# EAGLE design WILD_USB (EAGLE 9.6.2)
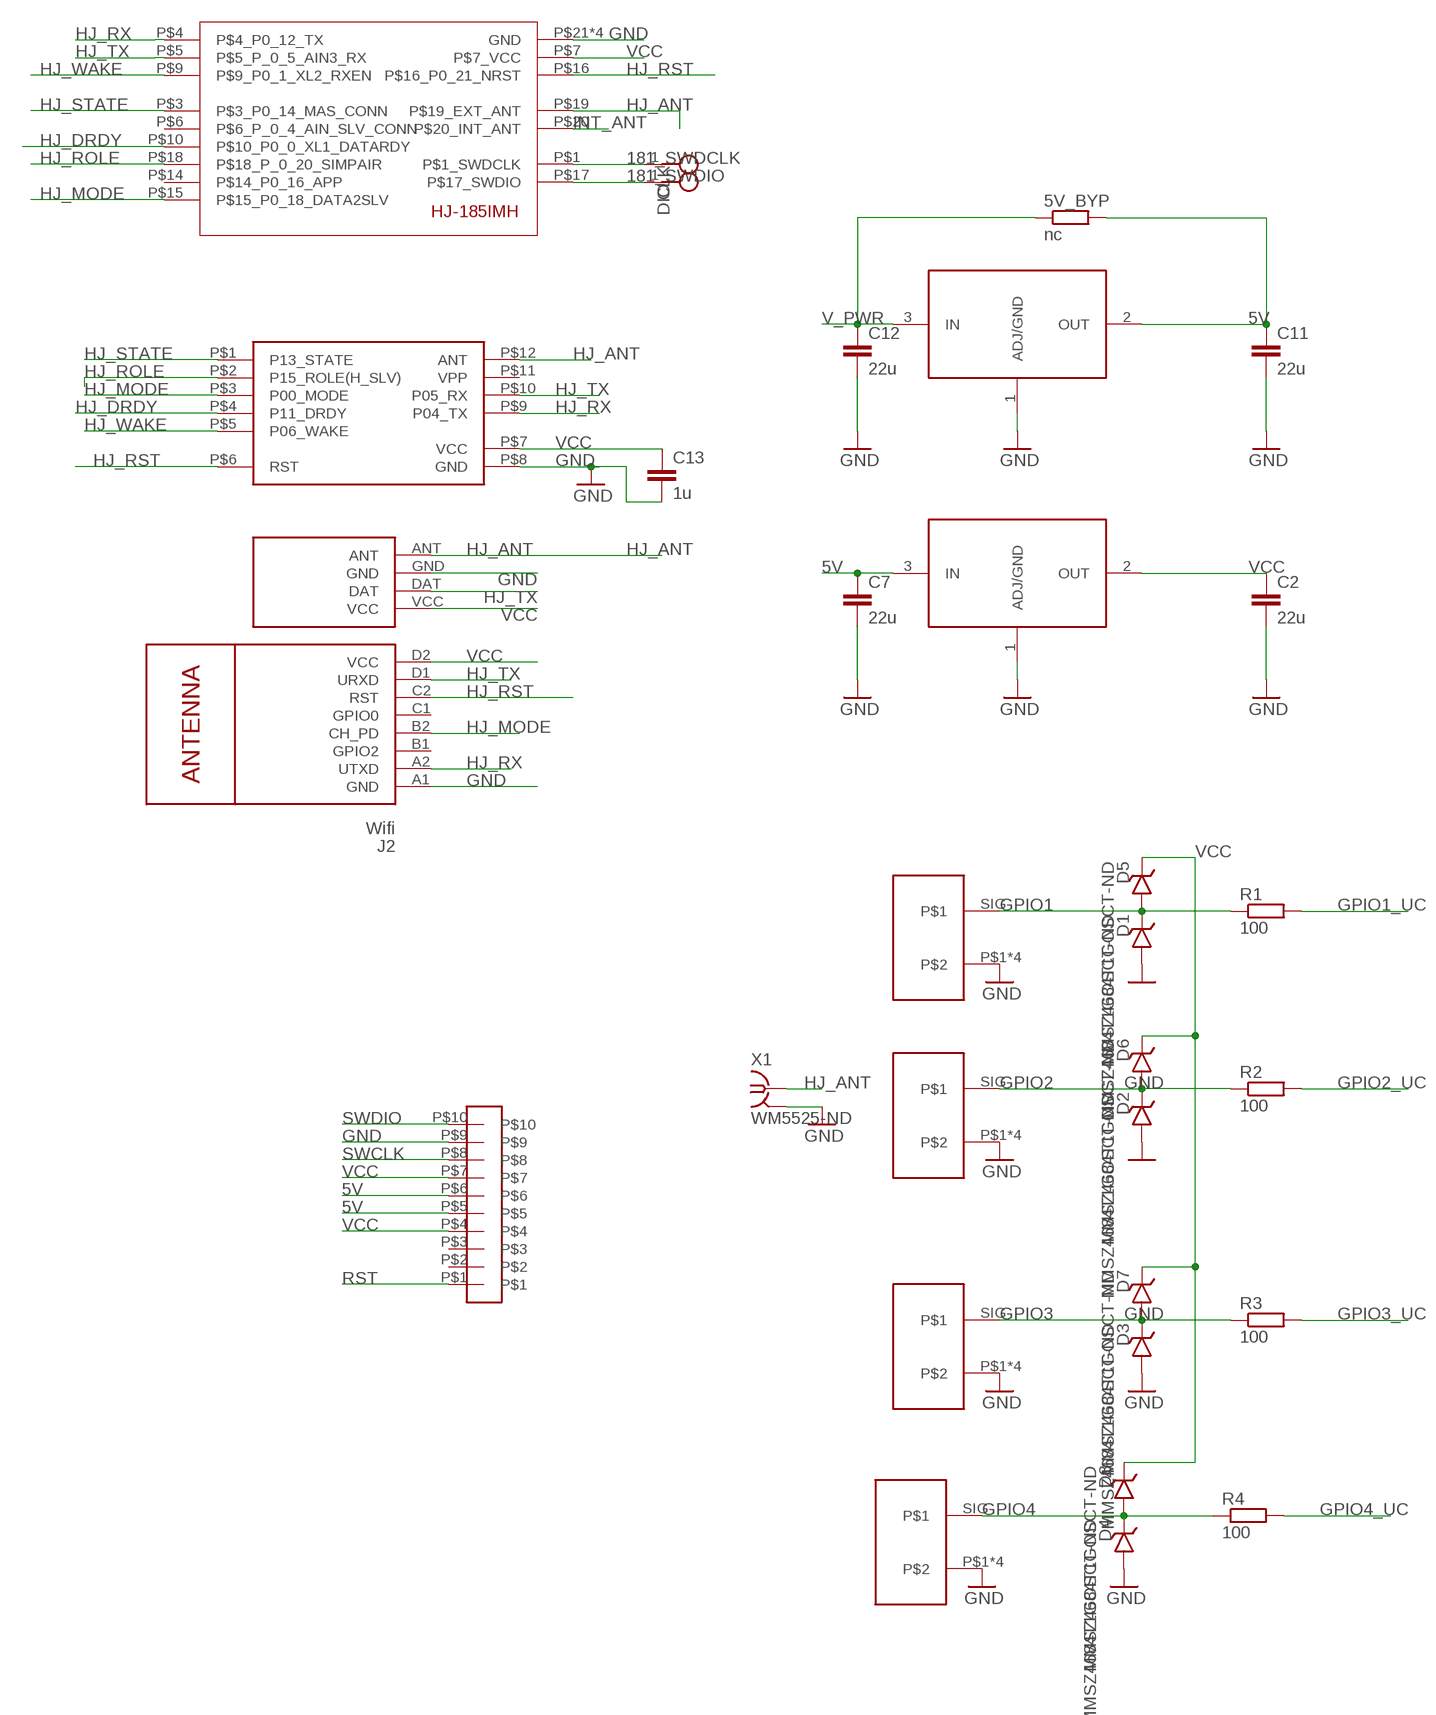
[diagram p0: schematic, sheet 1, part 1 of 2]
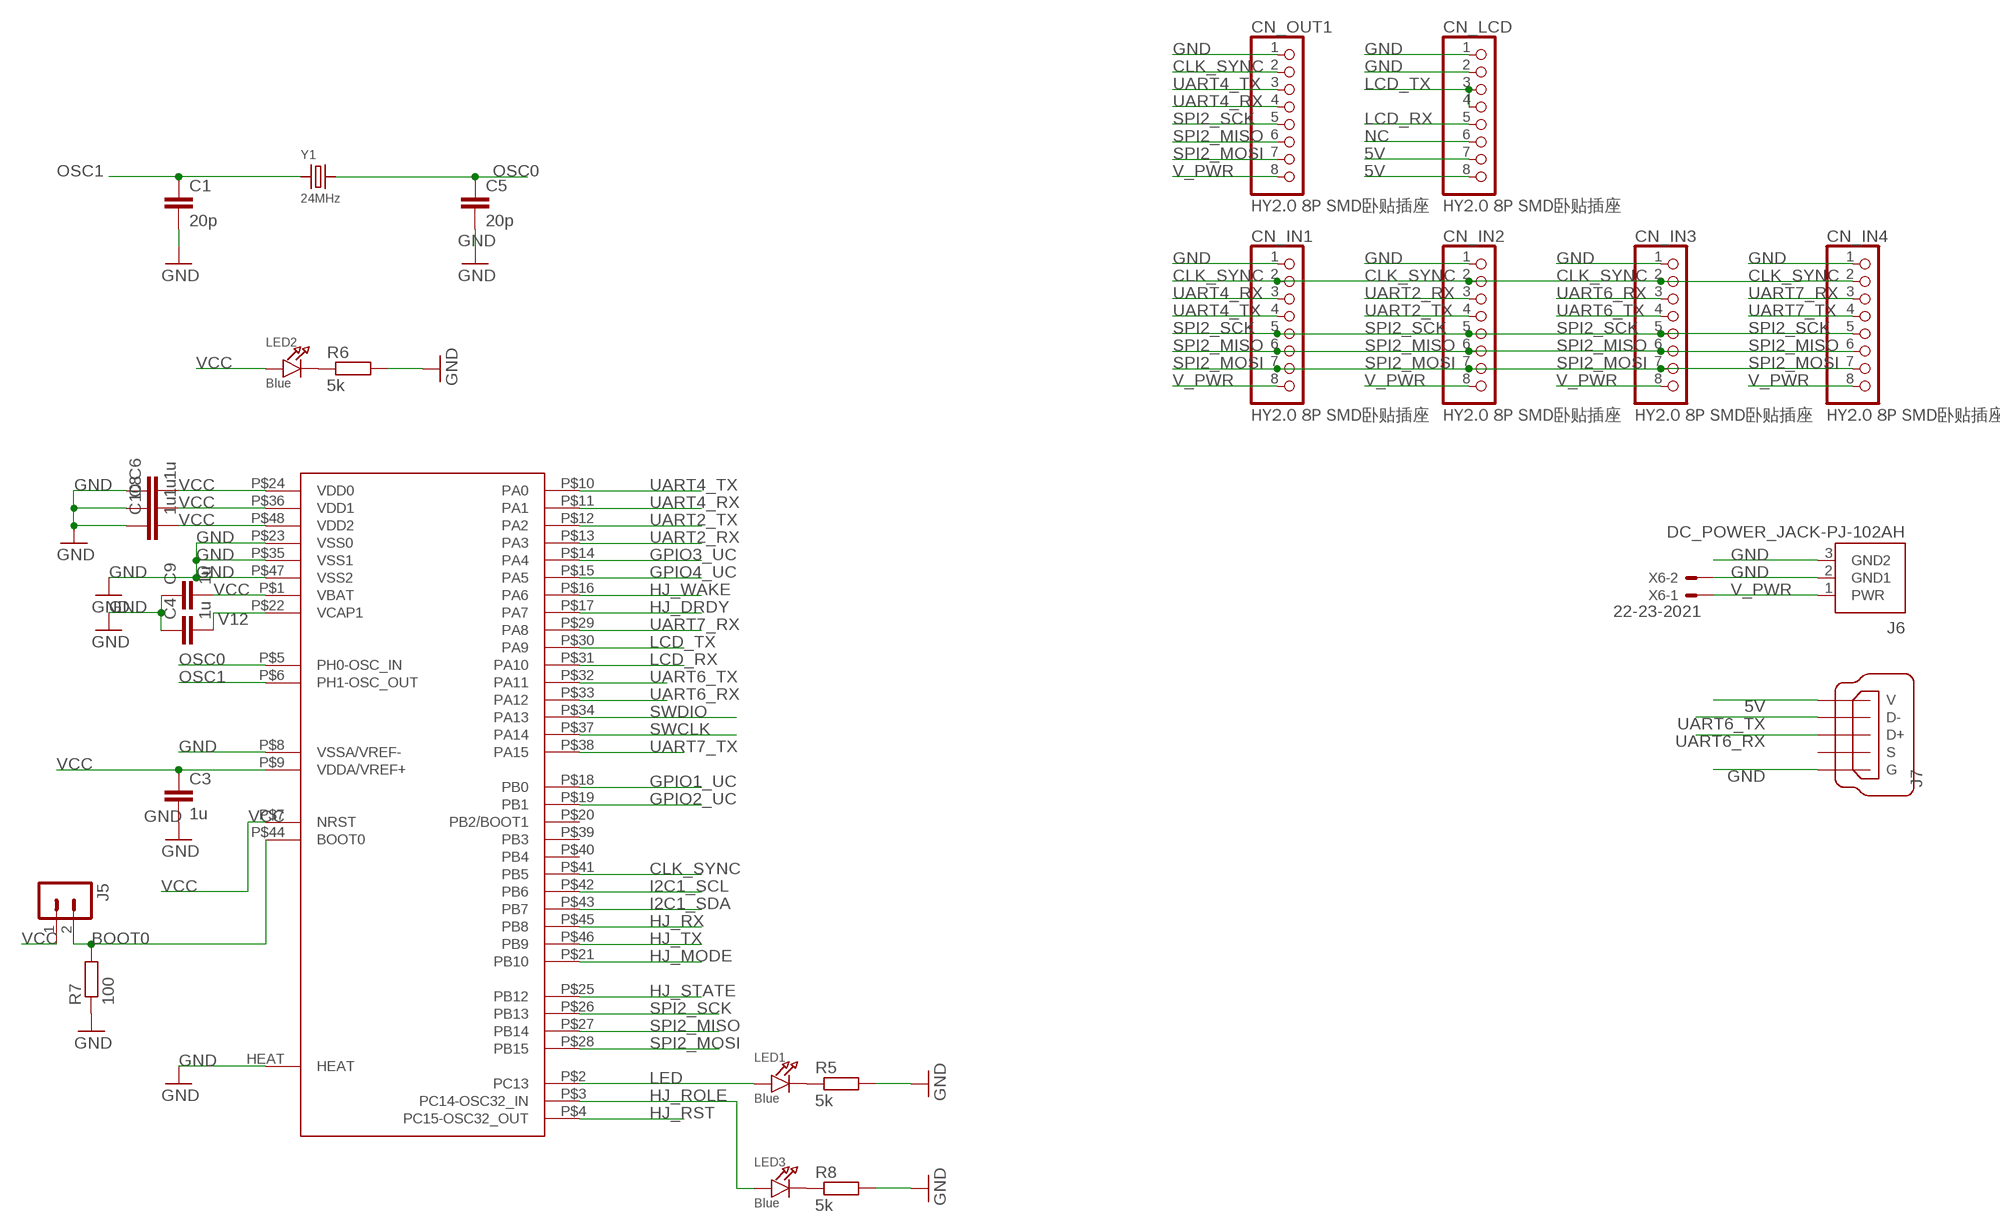
[diagram p1: schematic, sheet 1, part 2 of 2]

## Parts
5V_BYP  nc  RR1206  [R1206]
C1  20p  CC1206  [C1206]
C2  22u  CC1206  [C1206]
C3  1u  CC1206  [C1206]
C4  1u  CC1206  [C1206]
C5  20p  CC1206  [C1206]
C6  1u  CC1206  [C1206]
C7  22u  CC1206  [C1206]
C8  1u  CC1206  [C1206]
C9  1u  CC1206  [C1206]
C10  1u  CC1206  [C1206]
C11  22u  CC1206  [C1206]
C12  22u  CC1206  [C1206]
C13  1u  CC1206  [C1206]
CLK  TESTPOINT_SMALL  [TESTPOINT_SMALL]
CN_IN1  HY2.0 8P SMD卧贴插座  JST_8PIN  [JSTPH8]
CN_IN2  HY2.0 8P SMD卧贴插座  JST_8PIN  [JSTPH8]
CN_IN3  HY2.0 8P SMD卧贴插座  JST_8PIN  [JSTPH8]
CN_IN4  HY2.0 8P SMD卧贴插座  JST_8PIN  [JSTPH8]
CN_LCD  HY2.0 8P SMD卧贴插座  JST_8PIN  [JSTPH8]
CN_OUT1  HY2.0 8P SMD卧贴插座  JST_8PIN  [JSTPH8]
D1  MMSZ4684T1GOSCT-ND  DIODE_ZENER_SOD-123  [SOD-123]
D2  MMSZ4684T1GOSCT-ND  DIODE_ZENER_SOD-123  [SOD-123]
D3  MMSZ4684T1GOSCT-ND  DIODE_ZENER_SOD-123  [SOD-123]
D4  MMSZ4684T1GOSCT-ND  DIODE_ZENER_SOD-123  [SOD-123]
D5  MMSZ4684T1GOSCT-ND  DIODE_ZENER_SOD-123  [SOD-123]
D6  MMSZ4684T1GOSCT-ND  DIODE_ZENER_SOD-123  [SOD-123]
D7  MMSZ4684T1GOSCT-ND  DIODE_ZENER_SOD-123  [SOD-123]
D8  MMSZ4684T1GOSCT-ND  DIODE_ZENER_SOD-123  [SOD-123]
DIO  TESTPOINT_SMALL  [TESTPOINT_SMALL]
J1  Sub-GHz  SYN115  [SYN115]
J2  Wifi  WIRELESS-WIFI-ESP-01  [WIRELESS-WIFI-ESP-01]
J3  2*5P 2.54mm 双排母 母座  2.54MM_2X5  [2.54MM_2X5]
J5  nc  JUMPER2  [JUMPER2]
J6  DC_POWER_JACK-PJ-102AH  [PJ-102AH]
J7  J7  MICRO-USB-ZX62R-B-5P  [ZX62R-B-5P]
LED1  Blue  LED1206  [CHIPLED_1206]
LED2  Blue  LED1206  [CHIPLED_1206]
LED3  Blue  LED1206  [CHIPLED_1206]
R1  100  RR1206  [R1206]
R2  100  RR1206  [R1206]
R3  100  RR1206  [R1206]
R4  100  RR1206  [R1206]
R5  5k  RR1206  [R1206]
R6  5k  RR1206  [R1206]
R7  100  RR1206  [R1206]
R8  5k  RR1206  [R1206]
U1  STM32F413CHU6  STM32F411_QFN48  [UFQFPN48]
U2  HJ580  [HJ580]
U3  HJ_185IMHQFN  [HJ_185IMH]
U4  ADP3338AKCZ-3.3  AMS1117  [SOT223]
U5  nc  AMS1117  [SOT223]
X1  WM5525-ND  BU-SMA-H  [BU-SMA-H]
X2  BNC_8MM  [BNC_V_8MM]
X3  BNC_8MM  [BNC_V_8MM]
X4  BNC_8MM  [BNC_V_8MM]
X5  BNC_8MM  [BNC_V_8MM]
X6  22-23-2021  [22-23-2021]
Y1  24MHz  CRYSTALSMD  [HC49UP]

## Nets
5V: 5V_BYP.2 C7.1 C11.1 CN_LCD.7 CN_LCD.8 J3.P$5 J3.P$6 J7.1(V) U4.3(IN) U5.2(OUT)
181_SWDCLK: CLK.1 U3.P$1(P$1_SWDCLK)
181_SWDIO: DIO.1 U3.P$17(P$17_SWDIO)
BOOT0: J5.2 R7.2 U1.P$44(BOOT0)
CLK_SYNC: CN_IN1.2 CN_IN2.2 CN_IN3.2 CN_IN4.2 CN_OUT1.2 U1.P$41(PB5)
GND: C1.2 C2.2 C3.2 C4.1 C5.2 C6.1 C7.2 C8.1 C9.1 C10.1 C11.2 C12.2 C13.2 CN_IN1.1 CN_IN2.1 CN_IN3.1 CN_IN4.1 CN_LCD.1 CN_LCD.2 CN_OUT1.1 D1.2(A) D2.2(A) D3.2(A) D4.2(A) J1.GND J2.A1(GND) J3.P$9 J6.2(GND1) J6.3(GND2) J7.5(G) R5.2 R6.2 R7.1 R8.2 U1.HEAT U1.P$8(VSSA/VREF-) U1.P$23(VSS0) U1.P$35(VSS1) U1.P$47(VSS2) U2.P$8(GND) U3.P$21(GND) U3.P$22(GND) U3.P$23(GND) U3.P$24(GND) U4.1(ADJ/GND) U5.1(ADJ/GND) X1.2 X1.3 X1.4 X1.5 X2.P$1 X2.P$2 X2.P$3 X2.P$4 X3.P$1 X3.P$2 X3.P$3 X3.P$4 X4.P$1 X4.P$2 X4.P$3 X4.P$4 X5.P$1 X5.P$2 X5.P$3 X5.P$4 X6.2
GPIO1: D1.1(C) D5.2(A) R1.1 X2.SIG
GPIO1_UC: R1.2 U1.P$18(PB0)
GPIO2: D2.1(C) D6.2(A) R2.1 X3.SIG
GPIO2_UC: R2.2 U1.P$19(PB1)
GPIO3: D3.1(C) D7.2(A) R3.1 X4.SIG
GPIO3_UC: R3.2 U1.P$14(PA4)
GPIO4: D4.1(C) D8.2(A) R4.1 X5.SIG
GPIO4_UC: R4.2 U1.P$15(PA5)
HJ_ANT: J1.ANT U2.P$12(ANT) U3.P$19(P$19_EXT_ANT) X1.1
HJ_DRDY: U1.P$17(PA7) U2.P$4(P11_DRDY) U3.P$10(P$10_P0_0_XL1_DATARDY)
HJ_MODE: J2.B2(CH_PD) U1.P$21(PB10) U2.P$3(P00_MODE) U3.P$15(P$15_P0_18_DATA2SLV)
HJ_ROLE: LED3.A U1.P$3(PC14-OSC32_IN) U2.P$2(P15_ROLE(H_SLV)) U3.P$18(P$18_P_0_20_SIMPAIR)
HJ_RST: J2.C2(RST) U1.P$4(PC15-OSC32_OUT) U2.P$6(RST) U3.P$16(P$16_P0_21_NRST)
HJ_RX: J2.A2(UTXD) U1.P$45(PB8) U2.P$9(P04_TX) U3.P$4(P$4_P0_12_TX)
HJ_STATE: U1.P$25(PB12) U2.P$1(P13_STATE) U3.P$3(P$3_P0_14_MAS_CONN)
HJ_TX: J1.DAT J2.D1(URXD) U1.P$46(PB9) U2.P$10(P05_RX) U3.P$5(P$5_P_0_5_AIN3_RX)
HJ_WAKE: U1.P$16(PA6) U2.P$5(P06_WAKE) U3.P$9(P$9_P0_1_XL2_RXEN)
I2C1_SCL: U1.P$42(PB6)
I2C1_SDA: U1.P$43(PB7)
INT_ANT: U3.P$20(P$20_INT_ANT)
LCD_RX: CN_LCD.5 U1.P$31(PA10)
LCD_TX: CN_LCD.3 CN_LCD.4 U1.P$30(PA9)
LED: LED1.A U1.P$2(PC13)
N$6: LED3.C R8.1
N$9: LED1.C R5.1
N$18: LED2.C R6.1
NC: CN_LCD.6
OSC0: C5.1 U1.P$5(PH0-OSC_IN) Y1.2
OSC1: C1.1 U1.P$6(PH1-OSC_OUT) Y1.1
RST: J3.P$1
SPI2_MISO: CN_IN1.6 CN_IN2.6 CN_IN3.6 CN_IN4.6 CN_OUT1.6 U1.P$27(PB14)
SPI2_MOSI: CN_IN1.7 CN_IN2.7 CN_IN3.7 CN_IN4.7 CN_OUT1.7 U1.P$28(PB15)
SPI2_SCK: CN_IN1.5 CN_IN2.5 CN_IN3.5 CN_IN4.5 CN_OUT1.5 U1.P$26(PB13)
SWCLK: J3.P$8 U1.P$37(PA14)
SWDIO: J3.P$10 U1.P$34(PA13)
UART2_RX: CN_IN2.3 U1.P$13(PA3)
UART2_TX: CN_IN2.4 U1.P$12(PA2)
UART4_RX: CN_IN1.3 CN_OUT1.4 U1.P$11(PA1)
UART4_TX: CN_IN1.4 CN_OUT1.3 U1.P$10(PA0)
UART6_RX: CN_IN3.3 J7.3(D+) U1.P$33(PA12)
UART6_TX: CN_IN3.4 J7.2(D-) U1.P$32(PA11)
UART7_RX: CN_IN4.3 U1.P$29(PA8)
UART7_TX: CN_IN4.4 U1.P$38(PA15)
V12: C4.2 U1.P$22(VCAP1)
V_PWR: 5V_BYP.1 C12.1 CN_IN1.8 CN_IN2.8 CN_IN3.8 CN_IN4.8 CN_OUT1.8 J6.1(PWR) U5.3(IN) X6.1
VCC: C2.1 C3.1 C6.2 C8.2 C9.2 C10.2 C13.1 D5.1(C) D6.1(C) D7.1(C) D8.1(C) J1.VCC J2.D2(VCC) J3.P$4 J3.P$7 J5.1 LED2.A U1.P$1(VBAT) U1.P$7(NRST) U1.P$9(VDDA/VREF+) U1.P$24(VDD0) U1.P$36(VDD1) U1.P$48(VDD2) U2.P$7(VCC) U3.P$7(P$7_VCC) U4.2(OUT)
Unconnected: J2.B1(GPIO2) J2.C1(GPIO0) J3.P$2 J3.P$3 J7.4(S) J7.M1 J7.M2 J7.M3 J7.M4 U1.P$20(PB2/BOOT1) U1.P$39(PB3) U1.P$40(PB4) U2.P$11(VPP) U3.P$6(P$6_P_0_4_AIN_SLV_CONN) U3.P$14(P$14_P0_16_APP)

## Library data of the parts
5V_BYP R1-R8 = eagle-ltspice:R: RESISTOR, European symbol; SPICEMODEL: NONE; SPICEPREFIX: R
C1-C13 = eagle-ltspice:C: CAPACITOR, European symbol; SPICEMODEL: NONE; SPICEPREFIX: C
CLK DIO = HD128:TESTPOINT: PCB Test Point
CN_IN1-CN_IN4 CN_LCD CN_OUT1 = microbuilder:JST_8PIN: JST 8-Pin Right-Angle Connector
D1-D8 = INTAN_largeBGA:DIODE_ZENER: Zener diode
J1 = HD128:SYN115
J2 = diy-modules:WIRELESS-WIFI-ESP-01: Wireless Wi-Fi ESP-01 Module based on ESP8266 chip Click here to find device on ebay.com <http://www.ebay.com/sch/esp8266+esp+01+transceiver>
J3 = HD128:2.54MM_2X5
J5 = harrison:JUMPER2
J6 = INTAN_largeBGA:DC_POWER_JACK: DC Power Jack
J7 = con-hirose:MICRO-USB-: Hirose Micro USB Connector ZX62R-B-5P: Micro B, reverse (top mount) shell SMT Supplier: DigiKey H11574CT-ND Source: http://www.hirose.co.jp/cataloge_hp/e24200011.pdf
LED1-LED3 = microbuilder:LED: LED 0603 - 0603 Surface Mount Package 2mA: Green LED - Low Power (3.9mcd, 2ma, 1.7Vf) - Digikey: 475-2709-2-ND Orange LED - Low Power (9.8mcd, 2ma, 1.8Vf) - Digikey: 475-1194-2-ND Red LED - Low Power (5mcd, 2ma, 1.8Vf) - Digikey: 475-1195-2-ND Yellow LED - Low Power (7mcd, 2ma, 1.8Vf) - Digikey: 475-1196-2-ND 5mA: Blue LED - Low Power (17mcd, 5ma, 2.9Vf) - Digikey: LNJ937W8CRACT-ND 0805 - 0805 Surface Mount Package 2mA: Red LED (8.8mcd, 2mA, 1.8Vf, Clear) - Low Power [Digikey: 475-2510-1-ND] Green LED (5mcd, 2mA, 1.8Vf, Clear) - Low Power [Digikey: 475-2730-1-ND] Yellow LED (11.3mcd, 2mA, 1.8Vf, Clear) - Low Power [Digikey: 475-2555-1-ND] 20mA: Red LED (104mcd, 20mA, Diffused) - LS R976 [Digikey: 475-1278-6-ND] Red LED (12mcd, 20mA, 2.0Vf, Clear) - APT2012EC [Digikey: 754-1128-1-ND] Green LED (15mcd, 20mA, 2.2Vf, Clear) - APT2012GC [Digikey: 754-1131-1-ND] Orange LED (160mcd, 20mA, 2.1Vf, Clear) - APT2012SECK [Digikey: 754-1130-1-ND] 1206 - 1206 Surface Mount Package Green LED (26mcd, 20mA, Diffused) - LG N971 [Digikey: 475-1407-6-ND] Red LED (15mcd, 20mA, Diffused) - LH N974 [Digikey: 475-1416-6-ND]
U1 = HD128:STM32F411_QFN48
U2 = HD128:HJ580
U3 = HD128:HJ_185IMH
U4 U5 = HD128:AMS1117
X1 = con-coax:BU-SMA-H: FEMALE SMA CONNECTOR Radiall; OC_FARNELL: unknown; OC_NEWARK: unknown
X2-X5 = HD128:BNC_8MM
X6 = con-molex:22-23-2021: .100" (2.54mm) Center Header - 2 Pin; MF: MOLEX; MPN: 22-23-2021; OC_FARNELL: 1462926; OC_NEWARK: 25C3832
Y1 = microbuilder:CRYSTAL: Crystals HC49UP - Surface Mount Crystal 4.0MHz 18pF +/-30ppm Surface Mount Crystal [Digikey: 535-9857-1-ND] 12.0 MHz Surface Mount Crystal [Digikey: 535-9869-6-ND] 25.0 MHz Surface Mount Crystal [Digikey: 535-9078-1-ND] 2.5 x 2.0mm - MEMs SMT Crystal 16.0 MHz 10pF 20ppm 2.5 x 2.0mm Crystal [Digikey -40-85°C: 535-10923-1-ND] 3.2 x 2.5mm - MEMs SMT Crystal 12.0 MHz 8pF 15ppm 3.2 x 2.5mm Crystal [Digikey: -10-70°C: 644-1047-1-ND -40-125°C: 644-1128-1-ND] 16.0 MHz 8pF 15ppm 3.2 x 2.5mm Crystal [Digikey: -10-70°C: 644-1049-1-ND -40-125°C: 644-1129-2-ND] 16.0 MHz 10pF 10ppm 3.2 x 2.5mm Crystal [Digikey: 644-1100-1-ND] 27.12 MHz 18pF 30ppm 3.2 x 2.5mm Crystal [Digikey: 887-1424-1-ND] 27.12MHz 10pF 10ppm 3.2 x 2.5mm Crystal [Digikey: 887-1329-1-ND] 4.9 x 1.8mm - MEMs SMT Crystal 32.768 KHz 12.5pF 20ppm 4.9 x 1.8mm Crystal [Digikey: SE2415CT-ND] 8.0 x 3.8mm - Surface Mount Crystal 32.768kHz 12.5pF 20ppm -40°C-85°C [Digikey: 535-9166-2-ND] Cylinder 32.768KHz Cylinder Crystal (2x6mm body) [Ex. Digikey: 300-8341-2-ND]

## Board
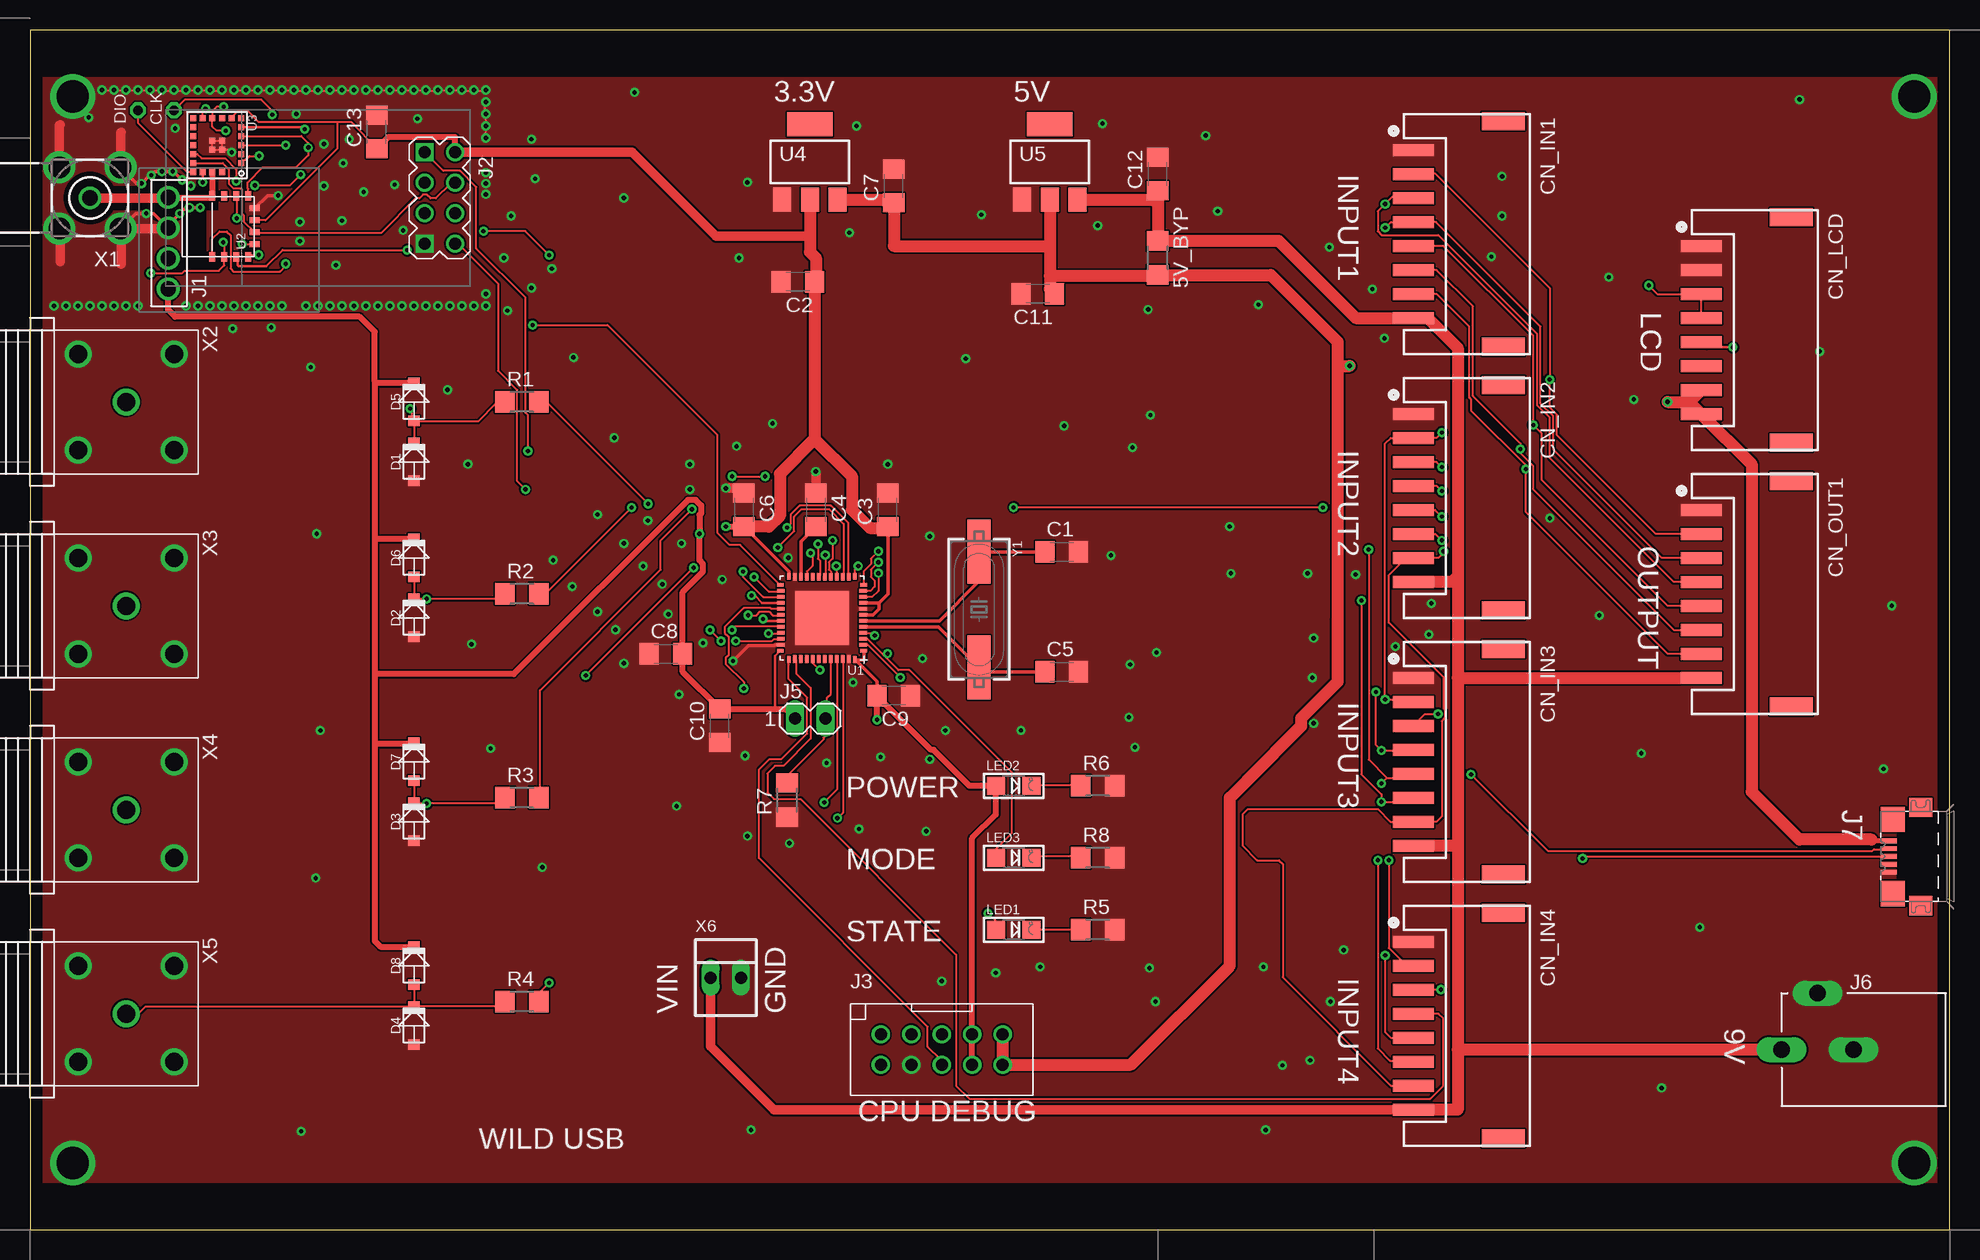
[diagram p2: board, top side]
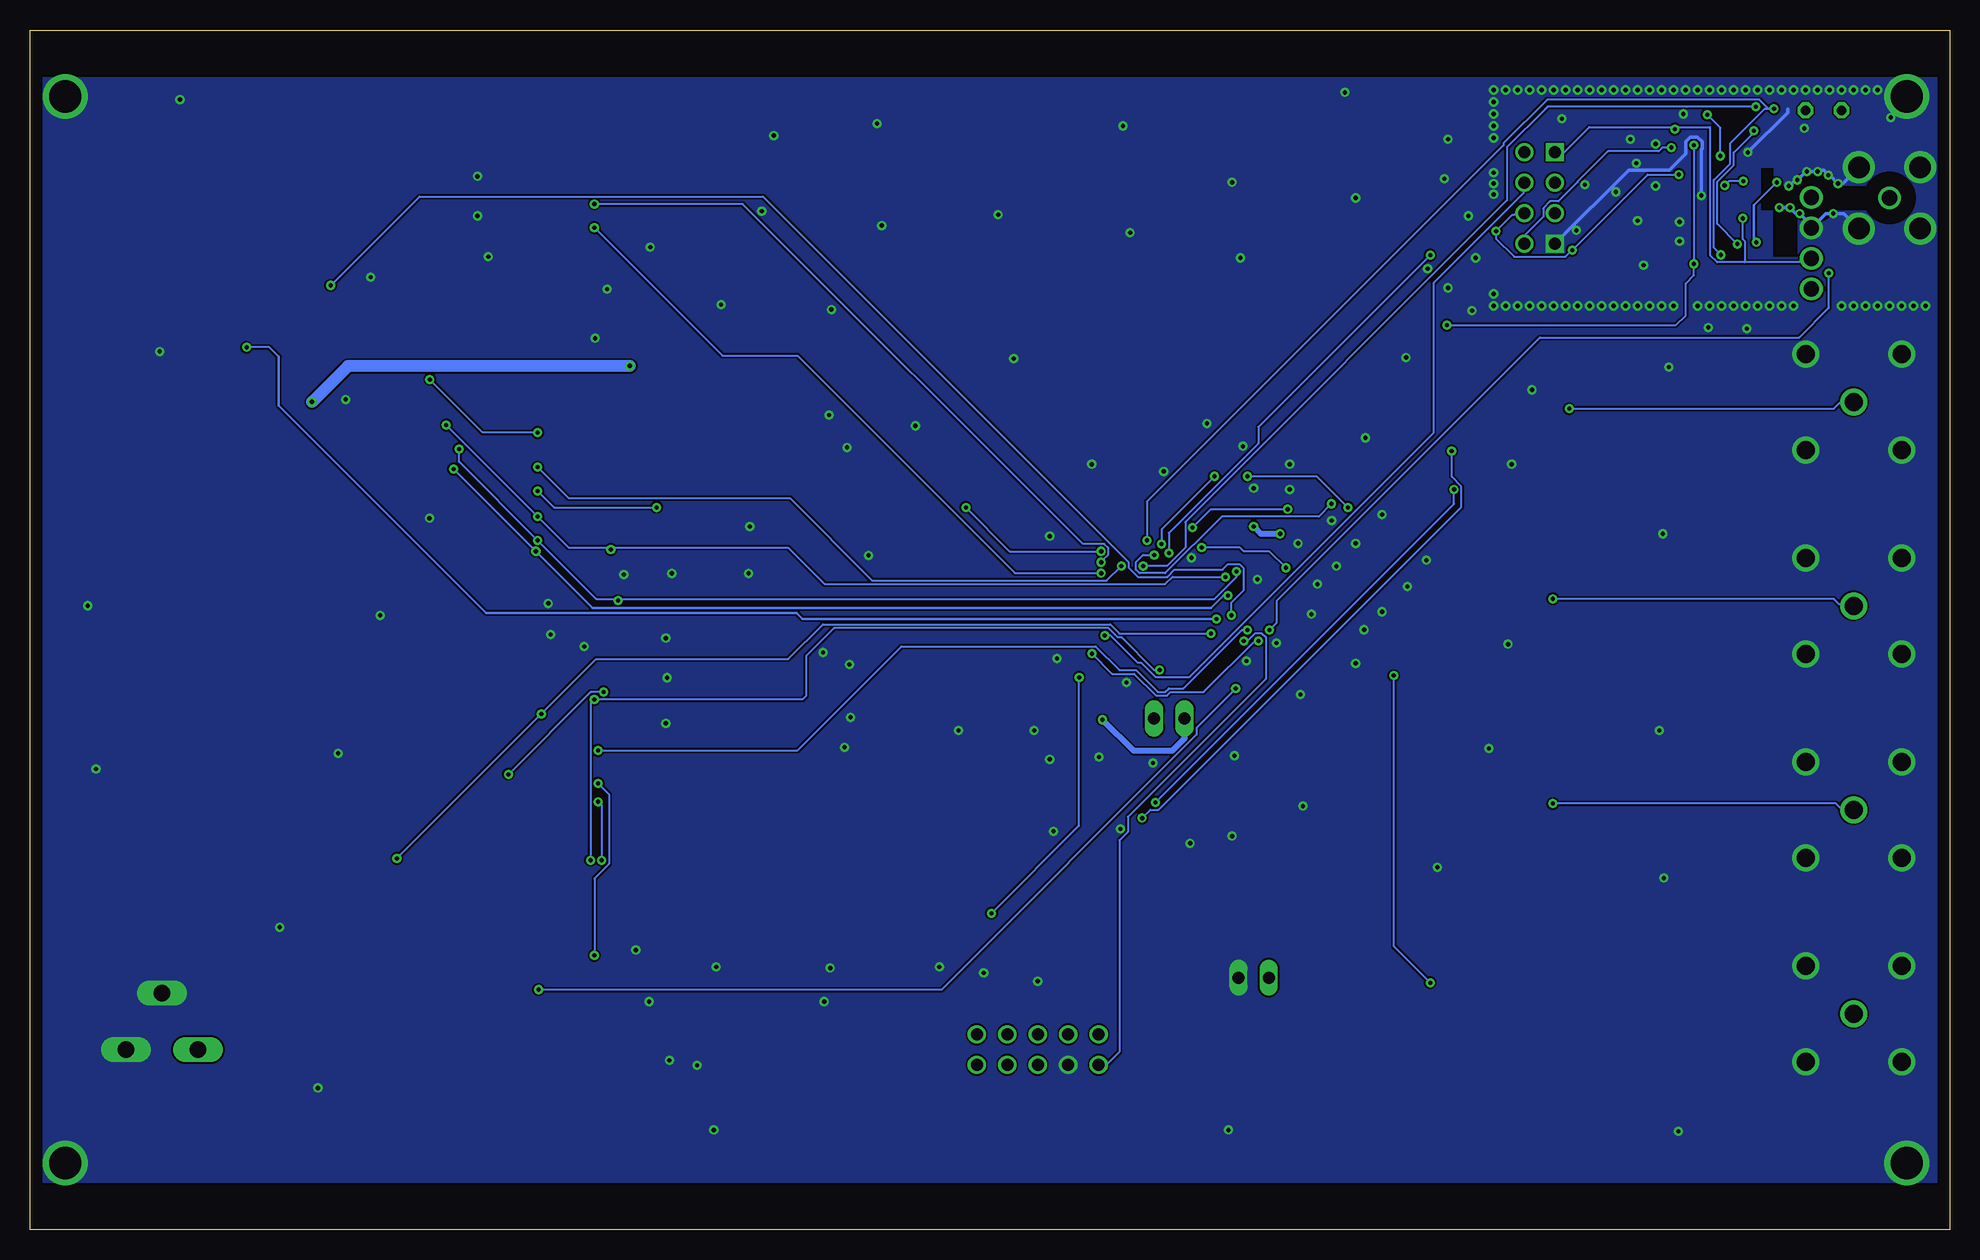
[diagram p3: board, bottom side, seen from below]

Size 160 x 100 mm. Coordinates in mm from the lower left corner, seen from the top.
Outline: 0,0 160,0 160,100 0,100 0,0
Copper layers (1*16): Top 0.035mm / dielectric 1.5mm / Bottom 0.035mm
Design rules "default *": minimum track width 6mil, minimum drill 0.35mm, track to track 6mil, track to pad 6mil, pad to pad 6mil, via to via 6mil, smd to smd 6mil, copper to edge 40mil, drill to drill 6mil, minimum pad ring 10mil, minimum via ring 8mil, stop-mask expansion 4mil, vias tented up to drill 0.6mm, thermal gap 10mil
tRestrict: area 0,0 to 160,3; area 0,97 to 160,100; area 4.3,85.3 to 5.7,86.7; area 4.7,85 to 15.7,87; area 14.7,85 to 15.7,88.5; area 10.7,85.4 to 12.1,86.8
bRestrict: area 0,97 to 160,100; area 0,0 to 160,3; area 0,97 to 160,100; area 4.3,85.3 to 5.7,86.7; area 4.7,85 to 15.7,87; area 14.7,85 to 15.7,88.5; area 10.7,85.4 to 12.1,86.8

### Footprints (pad centres in the part's own frame; a part is rotated, then mirrored left to right if it is on the bottom)
R1206 = smd 1.6 x 1.803: 1 -1.422,0; 2 1.422,0
C1206 = smd 1.6 x 1.8: 1 -1.4,0; 2 1.4,0
TESTPOINT_SMALL = drill 0.813 octagon: 1 0,0
JSTPH8 = smd 1 x 3.4: 1 -7,-3.7; 2 -5,-3.7; 3 -3,-3.7; 4 -1,-3.7; 5 1,-3.7; 6 3,-3.7; 7 5,-3.7; 8 7,-3.7 | smd 1.5 x 3.6: NC1 -9.4,3.8; NC2 9.4,3.8
SOD-123 = smd 0.9 x 0.95: 1 1.575,0; 2 -1.575,0
SYN115 = drill 1.27: ANT 5.08,-3.54; DAT 5.08,1.54; GND 5.08,-1; VCC 5.08,4.08
WIRELESS-WIFI-ESP-01 = drill 1 square: A1 -8.89,3.81; D1 -8.89,-3.81 | drill 1: A2 -11.43,3.81; B1 -8.89,1.27; B2 -11.43,1.27; C1 -8.89,-1.27; C2 -11.43,-1.27; D2 -11.43,-3.81
2.54MM_2X5 = drill 1: P$1 -5.08,1.27; P$2 -2.54,1.27; P$3 0,1.27; P$4 2.54,1.27; P$5 5.08,1.27; P$6 5.08,-1.27; P$7 2.54,-1.27; P$8 0,-1.27; P$9 -2.54,-1.27; P$10 -5.08,-1.27
JUMPER2 = drill 1.016 long: 1 -2.54,0; 2 0,0
PJ-102AH = drill 1.4 long: 1 0,-3; 2 0,3; 3 -4.7,0
ZX62R-B-5P = smd 1.35 x 0.4: 1 2.675,-1.3; 2 2.675,-0.65; 3 2.675,0; 4 2.675,0.65; 5 2.675,1.3 | smd 1.9 x 1.6: M1 0,-4.1; M2 0,4.1 | smd 2 x 2.1: M3 2.35,3.1; M4 2.35,-3.1
CHIPLED_1206 = smd 1.5 x 1.5: A 0,-1.496; C 0,1.496
UFQFPN48 = smd 4.5 x 4.5: HEAT 0,0 | smd 0.55 x 0.3: P$1 -3.475,2.75; P$12 -3.475,-2.75; P$25 3.475,-2.75; P$36 3.475,2.75 | smd 0.65 x 0.3: P$2 -3.425,2.25; P$3 -3.425,1.75; P$4 -3.425,1.25; P$5 -3.425,0.75; P$6 -3.425,0.25; P$7 -3.425,-0.25; P$8 -3.425,-0.75; P$9 -3.425,-1.25; P$10 -3.425,-1.75; P$11 -3.425,-2.25; P$26 3.425,-2.25; P$27 3.425,-1.75; P$28 3.425,-1.25; P$29 3.425,-0.75; P$30 3.425,-0.25; P$31 3.425,0.25; P$32 3.425,0.75; P$33 3.425,1.25; P$34 3.425,1.75; P$35 3.425,2.25 | smd 0.3 x 0.55: P$13 -2.75,-3.475; P$24 2.75,-3.475; P$37 2.75,3.475; P$48 -2.75,3.475 | smd 0.3 x 0.65: P$14 -2.25,-3.425; P$15 -1.75,-3.425; P$16 -1.25,-3.425; P$17 -0.75,-3.425; P$18 -0.25,-3.425; P$19 0.25,-3.425; P$20 0.75,-3.425; P$21 1.25,-3.425; P$22 1.75,-3.425; P$23 2.25,-3.425; P$38 2.25,3.425; P$39 1.75,3.425; P$40 1.25,3.425; P$41 0.75,3.425; P$42 0.25,3.425; P$43 -0.25,3.425; P$44 -0.75,3.425; P$45 -1.25,3.425; P$46 -1.75,3.425; P$47 -2.25,3.425
HJ580 = smd 0.8 x 0.5: P$1 -2.5,1.5; P$2 -2.5,0.5; P$3 -2.5,-0.5; P$4 -2.5,-1.5; P$9 2.552,-1.5; P$10 2.552,-0.5; P$11 2.552,0.5; P$12 2.552,1.5 | smd 0.5 x 0.8: P$5 -1.472,-2.042; P$6 -0.472,-2.042; P$7 0.528,-2.042; P$8 1.528,-2.042
HJ_185IMH = smd 0.5 x 0.5: P$1 1.5,2; P$2 0.75,2; P$3 0,2; P$4 -0.75,2; P$5 -1.5,2; P$6 -2.25,2; P$7 -2.25,1.2; P$8 -2.25,0.4; P$9 -2.25,-0.4; P$10 -2.25,-1.2; P$11 -2.25,-2; P$12 -1.5,-2; P$13 -0.75,-2; P$14 0,-2; P$15 0.75,-2; P$16 1.5,-2; P$17 2.25,-2; P$18 2.25,-1.2; P$19 2.25,-0.4; P$20 2.25,0.4; P$21 0.375,0.4; P$22 -0.375,0.4; P$23 -0.375,-0.4; P$24 0.375,-0.4
SOT223 = smd 1.5 x 2: 1 -2.3,-3.15; 2 0,-3.15; 3 2.3,-3.15 | smd 3.8 x 2: 4 0,3.15
BU-SMA-H = drill 1.27: 1 0,0 | drill 1.778: 2 -2.55,2.55; 3 2.55,2.55; 4 2.55,-2.55; 5 -2.55,-2.55
BNC_V_8MM = drill 1.5: P$1 -4,4; P$2 -4,-4; P$3 4,-4; P$4 4,4; SIG 0,0
22-23-2021 = drill 1 long: 1 -1.27,0; 2 1.27,0
HC49UP = smd 5.334 x 1.93: 1 -4.826,0; 2 4.826,0

### Placement (x,y rotation side)
5V_BYP  94,81 270 top
C1  86,56.5 0 top
C2  64,79 180 top
C3  71.5,60 90 top
C4  65.5,60 270 top
C5  86,46.5 0 top
C6  59.5,60 270 top
C7  72,87 90 top
C8  53,48 0 top
C9  72,44.5 180 top
C10  57.5,42 90 top
C11  84,78 180 top
C12  94,88 90 top
C13  28.9,91.5 90 top
CLK  12,93.3 0 top
CN_IN1  119,83 270 top
CN_IN2  119,61 270 top
CN_IN3  119,39 270 top
CN_IN4  119,17 270 top
CN_LCD  143,75 270 top
CN_OUT1  143,53 270 top
D1  32,64 90 top
D2  32,51 90 top
D3  32,34 90 top
D4  32,17 90 top
D5  32,69 90 top
D6  32,56 90 top
D7  32,39 90 top
D8  32,22 90 top
DIO  9,93.3 0 top
J1  16.6,82.5 180 top
J2  24,86 180 top
J3  76,15 0 top
J5  66.3,42.6 0 top
J6  149,15 270 top
J7  157.6,31.1 180 top
LED1  82,25 270 top
LED2  82,37 270 top
LED3  82,31 270 top
R1  41,69 0 top
R2  41,53 0 top
R3  41,36 0 top
R4  41,19 0 top
R5  89,25 0 top
R6  89,37 0 top
R7  63.1,35.8 90 top
R8  89,31 0 top
U1  66,51 180 top
U2  16.69,83.6 90 top
U3  15.6,90.4 270 top
U4  65,89 0 top
U5  85,89 0 top
X1  5,86 180 top
X2  8,69 180 top
X3  8,52 180 top
X4  8,35 180 top
X5  8,18 180 top
X6  58,21 0 top
Y1  79.1,51.7 270 top

### Tracks (layer width: path | path; a pad name or v marks a point on that pad's centre or on a via)
5V  (via drill 0.35)
  Top 0.4: 153.49,32.51 153.6,32.4 J7.1
  Top 1: U4.3 71.75,85.85 C7.1 72,82 85,82 | C11.1 85,78.4 85,79.5 | U5.2 85,82 | 85,82 85,79.5 | 85,79.5 93.92,79.5 5V_BYP.2 103.42,79.58 109,74 109,72 | 109,50.8 109,72 | 109,72 v110,72 | J3.P$5 J3.P$6 91.73,13.73 100,22 100,36 101.5,37.5 | v136.5,69 138.3,69 | 138.3,69 CN_LCD.8 143.5,63.8 143.5,36.5 147.49,32.51 153.49,32.51 | CN_LCD.7 138.3,69
  Top 1.016: 101.5,37.5 105.96,41.96 105.96,42.63 109,45.67 109,50.8
  Bottom 1: v110,72 133.5,72 v136.5,69
181_SWDCLK  (via drill 0.35)
  Top 0.152: U3.P$1 17.87,89.17 17.95,89.17 18.27,89.5 v19.1,89.5 | v20.2,92.94 20.2,93.27 19.27,94.2 12.9,94.2 CLK.1
  Bottom 0.152: v19.1,89.5 19.1,91.84 v20.2,92.94
181_SWDIO
  Top 0.152: U3.P$17 13.1,88.15 9,92.25 DIO.1
BOOT0
  Top 0.152: U1.P$44 66.75,47.55 66.75,44.65 66.45,44.35 66.45,42.67 J5.2 66.29,42.52 66.29,41.15 66.14,41 66.14,40.84 63.25,37.95 63.25,37.34 R7.2
CLK_SYNC  (via drill 0.35)
  Top 0.152: v65.84,46.63 65.23,47.24 65.23,47.55 U1.P$41 | v113.26,30.79 113.26,23.47 114.43,22.3 115,22.3 CN_IN4.2 | CN_OUT1.2 135.5,58 127.28,66.22 127.28,67.92 126.67,68.53 v126.67,70.87 126.67,78.49 117.13,88.03 115.33,88.03 CN_IN1.2 | v117.68,66.45 117.24,66 CN_IN2.2 113.43,66 112.96,65.53 v112.96,44.2 115.1,44.2 CN_IN3.2
  Bottom 0.152: v65.84,46.63 66.29,46.63 69.04,49.38 69.34,49.38 70.1,50.14 92.96,50.14 95.3,47.8 95.3,44.5 95.6,44.2 v112.96,44.2 113.26,43.89 v113.26,30.79 | v126.67,70.87 122.25,66.45 v117.68,66.45
GND  (via drill 0.35, 2.7)
  Top 0.152: v27,95 26.98,94.94 26.06,94.94 v26,95 25.91,94.94 25.15,94.94 v25,95 24.99,94.94 24.08,94.94 v24,95 23.93,94.94 23.01,94.94 v23,95 22.86,94.94 22.1,94.94 v22,95 21.95,94.94 21.03,94.94 v21,95 20.88,94.94 20.12,94.94 v20,95 19.96,94.94 19.05,94.94 v19,95 18.9,94.94 18.14,94.94 v18,95 17.98,94.94 17.07,94.94 v17,95 | v38,95 37.95,94.94 37.03,94.94 v37,95 36.88,94.94 36.12,94.94 v36,95 35.97,94.94 35.05,94.94 v35,95 34.9,94.94 34.14,94.94 v34,95 33.98,94.94 33.07,94.94 v33,95 32.92,94.94 32,94.94 v32,95 31.85,94.94 31.09,94.94 v31,95 30.94,94.94 30.02,94.94 v30,95 29.87,94.94 29.11,94.94 v29,95 28.96,94.94 28.04,94.94 v28,95 | v38,94 37.95,94.05 38,93.89 37.95,93.96 37.95,93.05 37.98,92.93 37.97,92.82 37.95,92.98 37.96,92.06 37.98,91.96 37.96,91.9 37.95,91.05 37.95,91 | v16,95 15.85,94.94 15.09,94.94 v15,95 14.94,94.94 14.02,94.94 v14,95 13.87,94.94 13.11,94.94 v13,95 12.95,94.94 12.04,94.94 v12,95 11.89,94.94 11.12,94.94 v11,95 10.97,94.94 10.06,94.94 v10,95 9.91,94.94 9.14,94.94 v9,95 8.99,94.94 8.08,94.94 v8,95 7.92,94.94 7.01,94.94 v7,95 6.86,94.94 6.1,94.94 v6,95 | U3.P$24 U3.P$21 U3.P$22 U3.P$23 U3.P$24
  Top 0.2: U3.P$21 16.57,90.03 v16.8,89.8 | U2.P$8 18.7,85.1
  Top 0.3: U2.P$8 19.8,86.2 v20.69,86.2 v20.7,86.2 | X1.5 8.9,87.2 v9.29,87.2 9.99,87.9 v10.09,87.9 10.39,88.2 v10.99,88.2 v11.89,88.2 11.99,88.2 v12.69,87.5 12.89,87.5 v13.39,87 | v14.19,85.2 v13.29,85.2 12.99,85.2 v12.49,84.7 11.52,83.73 J1.GND 10.32,84.7 v9.69,84.7 8.8,84.7 X1.2 | U1.P$35 62.09,48.75 62.03,48.69 59.89,48.69 v58.6,47.4
  Top 0.8: X1.4 2.45,92.05 2.5,92.1 | X1.5 7.55,91.45 7.6,91.5 | X1.3 2.5,83.4 2.5,80.7 | 7.6,80.5 7.6,83.4 X1.2 11.47,83.45 J1.GND | C4.1 v65.5,63.2 | C6.1 59.1,61.8 v58,61.8
  Bottom 0.3: v16.8,89.8 13.5,93.1 13.5,93.4 | v20.69,86.2 20.69,90.05 20.62,90.12 20.62,90.68 21.02,91.08 21.59,91.08 21.99,90.68 21.99,89.69 23.35,88.33 26.75,88.33 J2.A1 | X1.2 8.8,84.7 v9.69,84.7 10.32,84.7 J1.GND 11.52,83.73 v12.49,84.7 12.79,84.7 v13.29,85.2 v14.19,85.2 | v13.39,87 12.89,87.5 v12.69,87.5 11.99,88.2 v11.89,88.2 v10.99,88.2 10.89,88.3 10.49,88.3 v10.09,87.9 9.99,87.9 v9.29,87.2 8.9,87.2 X1.5
  other vias: 2,77 3,77 4,77 5,77 6,77 7,77 8,77 9,77 38,91 38,92 38,93 13,77 14,77 15,77 16,77 17,77 18,77 19,77 20,77 21,77 23,77 24,77 25,77 26,77 27,77 28,77 29,77 30,77 31,77 32,77 33,77 34,77 38,77 37,77 36,77 35,77 38,78 55,61.7 55,63.8 58.9,65.3 61.9,67.2 71.5,63.8 16.9,75.1 20.1,75.2 25.5,80.4 26,84.1 31.1,83.3 30.4,87.1 27.8,86.5 32.3,92.6 24.5,90.5 82.6,41.6 91.6,42.7 69.1,33.4 59.8,32.8 53.9,35.3 86.2,67 78,72.6 93.4,67.9 91.9,65.2 131.6,79.4 133.7,69.2 130.8,51.2 134.3,39.7 139.2,25.2 104.4,13.7 93.8,19 76.3,41.6 75,39.2 116.6,49.6 116.8,52.2 107,49.3 106.9,46 106.5,54.7 110.5,54.6 100.1,54.7 100,58.6 107,42.2 113.8,48.6 68.6,45.6 3.56,94.45 3.56,5.55 157.06,94.45 157.06,5.55 109.5,23.3 108.4,19 106.7,14.1 102.8,21.9 93.3,21.8 91.7,47.1 93.9,48.1 92.1,40.2 63.3,32.2 70.9,39.4 74.7,33.2 42.7,30.2 38.4,40.1 36.8,48.8 24.2,41.6 23.8,29.3 23.9,58 23.4,71.9 34.8,70 36.5,63.8 45.3,72.7 42.1,87.6 41.8,90.9 12.1,91.8 4.9,92.7 22.5,84 22.5,82.4 24.5,87 26.1,88.9 26.6,90.9 22.2,93 40.1,84.5 39.5,81 43.5,80.1 39.8,76.6 41.8,78.5 54.3,57.2 57.7,54.2 51.5,59.1 49.5,57.2 47.3,59.6 51.1,55.3 52.7,53.8 53.2,51.3 56.1,48.9 49.5,47.2 48.8,50 47.3,51.5 45.2,53.6 43.6,55.8 63.2,56 75,57.8 74.4,47.6 90.1,56.2 59.6,39.5 54.1,44.6 66.4,38.9 76,20.7 80.5,21.4 84.2,21.9 79.3,84.6 59.8,87.3 98,91.2 89.4,92.2 68.9,92 154.5,38.4 155.2,52 149.2,73.2 126.7,59.3 136,11.8 103,8.3 22.6,8.2 60.1,8.3 50.4,94.8 147.5,94.2 121.8,81.1 122.7,84.5 122.7,87.8 112.9,74.3 111.9,78.4 108.3,81.9 99,84.9 102.4,77.1 93.2,76.7 89,83.7 59.1,81 68.3,83.1 49.5,86 48.7,66 38,88.1 38,87.2 38,86.3
  pour Top (no thermals): 1,96 159,96 159,4 1,4
  pour Bottom (no thermals): 1,96 159,96 159,4 1,4
GPIO1  (via drill 0.35)
  Top 0.152: 32,67.36 32,65.68 D1.1 | 32,67.36 37.34,67.36 38.86,68.89 39.47,68.89 R1.1 | 32,67.36 D5.2 31.85,67.51 31.85,68.28 v31.7,68.43
  Bottom 0.152: v31.7,68.43 9.63,68.43 9.17,68.89 8.11,68.89 X2.SIG
GPIO1_UC  (via drill 0.35)
  Top 0.152: v66.29,56.24 66.29,54.56 U1.P$18 | v51.51,60.5 43.13,68.89 42.52,68.89 R1.2
  Bottom 0.152: v66.29,56.24 67.21,56.24 67.82,55.63 67.82,55.02 67.51,54.71 65.38,54.71 60.66,59.44 52.58,59.44 v51.51,60.5
GPIO2  (via drill 0.35)
  Top 0.152: D2.1 32,54.41 D6.2 | D2.1 v33.07,52.58 39.17,52.58 39.47,52.88 R2.1 | D2.1
  Bottom 0.152: v33.07,52.58 9.63,52.58 9.17,52.12 8.11,52.12 8,52.01 X3.SIG
GPIO2_UC  (via drill 0.35)
  Top 0.152: v65.68,57.15 65.68,55.93 65.84,55.78 65.84,54.56 U1.P$19 | v58.52,62.79 v61.27,62.79 | v50.14,60.2 42.98,53.03 42.52,53.03 R2.2
  Bottom 0.152: v65.68,57.15 65.68,58.37 v61.27,62.79 | v58.52,62.79 52.73,62.79 v50.14,60.2
GPIO3  (via drill 0.35)
  Top 0.152: D7.2 32,37.34 32,35.66 D3.1 32,35.51 v33.07,35.51 39.01,35.51 39.47,35.97 R3.1
  Bottom 0.152: v33.07,35.51 9.48,35.51 9.02,35.05 8.3,35.05 8.11,35.05 8.05,35.05 X4.SIG
GPIO3_UC  (via drill 0.35)
  Top 0.152: v55.17,60.05 52.58,57.45 52.58,55.02 42.52,44.96 42.52,36.12 R3.2 | v63.09,58.52 63.4,58.83 63.4,59.59 64.16,60.35 66.75,60.35 68.22,58.88 68.22,54.76 68.28,54.71 68.28,54.56 U1.P$14
  Bottom 0.152: v55.17,60.05 61.57,60.05 v63.09,58.52
GPIO4
  Top 0.152: 32,18.59 D8.2 | 32,18.59 39.17,18.59 39.47,18.9 R4.1 | 32,18.59 D4.1 31.85,18.59 9.63,18.59 9.17,18.14 8.4,18.14 8.14,18.14 X5.SIG
GPIO4_UC  (via drill 0.35)
  Top 0.152: v62.33,56.84 63.7,58.22 63.7,59.44 64.31,60.05 66.6,60.05 67.82,58.83 67.82,54.56 U1.P$15 | v46.33,46.18 v55.32,55.17 | v43.28,20.57 42.52,19.81 42.52,19.05 R4.2
  Bottom 0.152: v62.33,56.84 59.13,56.84 58.83,56.54 56.69,56.54 v55.32,55.17 | v46.33,46.18 46.33,23.62 v43.28,20.57
HJ_ANT
  Top 0.5: J1.ANT 15.08,86.04 U2.P$12 15.2,86.16 U3.P$19
  Top 0.8: X1.1 11.48,86 J1.ANT
HJ_DRDY  (via drill 0.35)
  Top 0.152: v66.9,57.45 66.9,55.93 66.6,55.63 66.6,55.02 66.75,54.86 66.75,54.56 U1.P$17 | U3.P$10 14.4,93.21 v14.63,93.44 | U2.P$4 18.34,81.25 v19.05,81.25
  Bottom 0.152: 15.09,93.44 15.39,93.44 18.29,90.54 18.29,88.87 19.66,87.5 19.66,81.86 v19.05,81.25 | 15.09,93.44 v14.63,93.44 | v66.9,57.45 66.9,60.67 37.19,90.39 37.19,90.54 33.53,94.2 15.85,94.2 15.09,93.44
HJ_MODE  (via drill 0.35)
  Top 0.152: v65.08,56.39 65.23,56.24 65.23,55.32 64.77,54.86 64.77,54.56 U1.P$21 | v37.8,83.23 41.28,83.23 v43.28,81.23 | v18.75,87.04 21.64,87.04 v22.55,87.95 | U3.P$15 13.95,89.65 14.3,89.3 16.27,89.3 17.2,88.37 v17.2,87.4 | 21.05,81.65 | 21.05,81.65 v31.45,81.65
  Top 0.2: U2.P$3 17.3,80.99 17.3,80.4 17.4,80.3 19.7,80.3 21.05,81.65
  Bottom 0.152: v65.08,56.39 65.08,58.06 57.61,65.53 57.61,66.9 v43.28,81.23 | v22.55,87.95 25.15,87.95 v31.45,81.65 32,81.1 36.27,81.1 37.8,82.62 v37.8,83.23 36.42,84.6 36.27,84.6 36.14,84.73 J2.B2 | v17.2,87.4 18.38,87.4 v18.75,87.04
HJ_ROLE  (via drill 0.35)
  Top 0.152: 71.17,47.85 72.39,46.63 73.3,46.63 81.84,38.1 81.84,33.07 80.47,31.7 80.47,31.09 LED3.A | 71.17,47.85 69.8,49.23 69.49,49.23 U1.P$3 | v10.06,79.72 12.69,79.72 12.9,79.93 15.74,79.93 16.15,80.34 16.19,80.38 U2.P$2 16.19,82.22 v16.11,82.3 | v57.61,49.07 v56.69,49.99 | v71.48,48.01 71.32,48.01 71.17,47.85
  Top 0.2: U3.P$18 v14.4,87.3
  Bottom 0.152: v56.69,49.99 56.08,50.6 56.08,52.43 34.14,74.37 12.53,74.37 10.06,76.84 v10.06,79.72 | v57.61,49.07 57.91,49.07 62.18,44.81 64.92,44.81 65.23,44.5 66.14,44.5 67.97,46.33 69.8,46.33 v71.48,48.01
  Bottom 0.2: v14.4,87.3 16.3,85.4 16.3,82.3 v16.11,82.3
HJ_RST  (via drill 0.35)
  Top 0.152: v70.41,49.53 70.26,49.68 69.49,49.68 U1.P$4 | U3.P$16 16.07,88.9 16.48,88.5 16.48,88.46 16.6,88.34 16.6,87.66 16.59,87.65 16.59,87.15 16.96,86.78 17.54,86.78 17.67,86.65 17.67,84.71 17.83,84.55 17.83,84.03 U2.P$6 18.78,83.08 29.26,83.08 32.16,85.97 32.46,85.97 32.77,86.28 33.07,86.28 33.38,85.97 33.83,85.97 35.05,87.19 35.3,87.19 35.35,87.19 J2.C2
  Bottom 0.152: v70.41,49.53 69.95,49.53 67.67,47.24 67.36,47.24 66.14,46.02 63.4,46.02 43.01,66.41 43.01,78.88 35.51,86.39 35.51,87.19 J2.C2
HJ_RX  (via drill 0.35)
  Top 0.152: U3.P$4 22.61,91.15 23.2,90.56 v23.2,90.2 23.2,89.56 22.2,88.56 19.41,88.56 18.14,87.29 18.14,86.79 18.19,86.74 U2.P$9 | U1.P$45 67.25,43.81 67.29,43.77 67.29,36.69 v66.2,35.6 | v41.3,61.7 40.61,62.39 40.61,70 39,71.6 39,78.86 35.67,82.19 J2.A2
  Bottom 0.152: v23.2,90.2 23.94,90.2 24.25,89.89 28.46,89.89 31.01,87.35 31.01,87.29 32.59,85.71 33.3,85.71 33.87,85.14 33.87,84.43 35.43,82.87 J2.A2 | v66.2,35.6 41.3,60.5 v41.3,61.7
HJ_STATE  (via drill 0.35)
  Top 0.152: v21.3,80.5 21.3,80.34 20.84,79.87 16.95,79.87 16.71,80.11 16.71,82.89 16.4,83.2 15.8,83.2 15.19,82.59 U2.P$1 | U3.P$3 v21.3,90.4 | U1.P$25 59.2,57.07 58.3,57.07 57.31,58.06 57.31,66.23 48.14,75.4 v41.9,75.4
  Bottom 0.152: v21.3,90.4 v21.3,90.39 v21.3,80.5 21.3,79.56 22,78.86 22,76.2 22.8,75.4 v41.9,75.4
HJ_TX  (via drill 0.35)
  Top 0.152: U1.P$46 67.75,34.75 v67.3,34.3 | v41.5,64.9 41.5,67.9 41.29,68.1 41.29,77.67 37.19,81.78 37.19,86.9 35.84,88.25 34.45,88.25 J2.D1 | U2.P$10 17.22,86.12 v17.22,84.3
  Top 0.2: U3.P$5 22.72,91.9 v22.9,91.72
  Bottom 0.152: 17.1,80.64 11.52,80.64 11.52,80.65 J1.DAT | 22.9,91.92 30.02,91.92 32.16,89.78 32.86,89.78 J2.D1 | 22.9,91.92 19.96,91.92 19.96,81.25 19.36,80.64 17.1,80.64 | v17.22,84.3 17.22,82.56 17.07,82.41 17.07,80.67 17.1,80.64 | v67.3,34.3 66.61,34.99 65.95,34.99 40.69,60.25 40.69,61.95 41.5,62.76 v41.5,64.9 | v22.9,91.72 22.9,91.92
HJ_WAKE  (via drill 0.35)
  Top 0.152: v16.31,91.61 15.54,91.61 15.2,91.96 U3.P$9 15.2,93.15 15.24,93.19 15.24,93.28 15.54,93.59 v16.15,93.59 | v67.21,55.32 67.21,54.56 U1.P$16 | v17.68,82.16 18.7,82.16 U2.P$5
  Bottom 0.152: v16.31,91.61 16.31,91.45 17.98,89.78 17.98,88.72 19.36,87.34 19.36,83.84 v17.68,82.16 | v67.21,55.32 65.23,55.32 63.7,56.84 63.7,58.98 36.88,85.8 36.88,90.23 33.71,93.41 33.58,93.53 33.51,93.61 21.95,93.61 21.93,93.59 v16.15,93.59
LCD_RX  (via drill 0.35)
  Top 0.2: U1.P$31 61.25,50.75 v61.1,50.9 | v141.95,73.55 139.75,73.55 CN_LCD.5
  Bottom 0.152: 139.25,72.75 140.05,73.55 v141.95,73.55
  Bottom 0.2: v61.1,50.9 95.59,50.9 96.09,51.4 121.97,51.4 139.25,68.69 139.25,72.75
LCD_TX  (via drill 0.35)
  Top 0.152: U1.P$30 62.52,51.2 61.9,51.2 61.59,51.51 60.85,51.51 60.55,51.21 v59.87,51.21 | CN_LCD.4 CN_LCD.3 135.64,78 v134.93,78.7
  Bottom 0.152: v134.93,78.7 127.53,86.11 98.91,86.11 68.43,55.63 68.43,55.17 67.67,54.41 65.2,54.41 64.59,55.01 60.6,55.01 60.15,55.47 59.19,55.47 58.83,55.12 58.83,53.3 59.87,52.26 v59.87,51.21
LED  (via drill 0.35)
  Top 0.152: v72.54,46.02 69.8,48.77 69.49,48.77 U1.P$2 | v79.86,26.36 80.47,25.76 80.47,25.15 LED1.A
  Bottom 0.152: v72.54,46.02 72.54,33.68 v79.86,26.36
N$6
  Top 0.152: LED3.C 83.52,31.09 87.48,31.09 R8.1
N$9
  Top 0.152: LED1.C 83.52,24.99 87.48,24.99 R5.1
N$18
  Top 0.152: LED2.C 83.52,37.03 87.48,37.03 R6.1
OSC0
  Top 0.3: U1.P$5 75.72,50.25 Y1.2 79.47,46.5 C5.1
OSC1
  Top 0.3: U1.P$6 75.82,50.75 79.04,53.96 79.04,56.46 79.07,56.5 | 79.07,56.5 Y1.1 | C1.1 79.07,56.5
SPI2_MISO  (via drill 0.35)
  Top 0.152: v112.35,30.79 112.35,15.09 113.37,14.07 115.23,14.07 CN_IN4.6 | v59.44,54.86 59.44,54.41 61.11,52.73 62.48,52.73 U1.P$27 | v110.98,52.43 110.98,37.95 112.65,36.27 v112.65,35.66 114.96,35.66 CN_IN3.6 | CN_IN1.6 117.23,80 120.27,76.96 120.27,69.49 124.23,65.53 v124.23,65.08 124.23,64.71 125.3,63.65 125.3,61.7 137,50 CN_OUT1.6 | CN_IN2.6 117.14,58 v117.68,57.45
  Bottom 0.152: v112.35,30.79 112.35,35.36 v112.65,35.66 | v59.44,54.86 59.44,54.41 61.27,52.58 110.98,52.58 | 110.98,52.58 112.81,52.58 v117.68,57.45 124.23,64.01 v124.23,65.08 | 110.98,52.58 v110.98,52.43
SPI2_MOSI  (via drill 0.35)
  Top 0.152: CN_OUT1.7 136.5,48 124.69,59.81 v124.69,63.4 124.84,63.55 120.12,68.28 120.12,69.19 119.97,69.34 119.97,75.29 117.25,78 CN_IN1.7 | CN_IN4.7 113.45,12 104.42,21.03 104.42,30.48 104.12,30.79 102.29,30.79 101.07,32 101.07,34.59 101.53,35.05 112.35,35.05 113.4,34 CN_IN3.7 117.24,34 117.68,34.44 117.68,42.37 117.99,42.67 117.99,43.28 117.83,43.43 117.83,46.02 113.26,50.6 113.26,54.56 114.7,56 CN_IN2.7 117.4,56 117.83,56.43 v117.83,56.54
  Top 0.2: U1.P$28 61.03,52.25 60.44,52.84 v60.14,52.84
  Bottom 0.152: v124.69,63.4 117.85,56.55 v117.83,56.54
  Bottom 0.2: v60.14,52.84 60.54,52.84 61.58,51.8 113.09,51.8 117.85,56.55
SPI2_SCK  (via drill 0.35)
  Top 0.152: v112.96,22.86 112.96,16.46 113.42,16 CN_IN4.5 | 113.11,37.64 v112.65,37.19 | v60.35,54.41 61.57,53.19 62.48,53.19 U1.P$26 | v117.68,59.44 117.12,60 CN_IN2.5 | 113.11,37.64 111.59,39.17 v111.59,56.69 | CN_OUT1.5 136.5,52 126,62.5 126,66.36 v125.3,67.06 125.3,74.52 117.83,82 CN_IN1.5 | 113.11,37.64 114.94,37.64 CN_IN3.5
  Bottom 0.152: v112.96,22.86 112.96,29.26 111.74,30.48 111.74,36.27 v112.65,37.19 | v60.35,54.41 64.77,54.41 65.38,53.8 93.75,53.8 96.8,56.84 111.59,56.84 | 111.59,56.84 115.09,56.84 v117.68,59.44 v125.3,67.06 | 111.59,56.84 v111.59,56.69
SWCLK
  Top 0.152: U1.P$37 63.25,47.4 63.25,47.09 63.24,47.09 63.24,45.88 64.78,44.34 64.78,43.44 64.77,43.43 64.77,41.6 64.78,41.6 64.78,41.35 62.64,39.21 61.63,39.21 60.77,38.35 60.77,30.98 74.83,16.92 74.83,15.24 75.89,14.17 75.89,13.87 J3.P$8
SWDIO  (via drill 0.35)
  Top 0.152: v58.83,49.07 61.87,49.07 62.03,49.23 62.48,49.23 U1.P$34
  Bottom 0.152: v58.83,49.07 58.52,49.07 57.91,49.68 57.3,49.68 57,49.38 57,45.9 68.49,34.41 68.49,33.15 69.2,32.44 69.2,14.8 70.27,13.73 J3.P$10
UART2_RX  (via drill 0.35)
  Top 0.152: v69.04,55.32 68.73,55.02 68.73,54.56 U1.P$13 | CN_IN2.3 117.23,64 v117.68,63.55
  Bottom 0.152: v69.04,55.32 70.26,54.1 89.79,54.1 96.65,60.96 115.09,60.96 v117.68,63.55
UART2_TX  (via drill 0.35)
  Top 0.152: v70.71,56.54 70.1,55.93 70.1,55.47 69.49,54.86 69.49,53.8 U1.P$12 | v107.78,60.2 v81.99,60.2 | CN_IN2.4 117.25,62 v117.68,61.57
  Bottom 0.152: v70.71,56.54 78.33,56.54 v81.99,60.2 | v107.78,60.2 116.31,60.2 v117.68,61.57
UART4_RX  (via drill 0.35)
  Top 0.152: U1.P$11 69.44,53.24 70.05,53.24 70.41,53.6 70.41,54.1 70.1,54.41 70.1,55.02 v70.71,55.63 | CN_OUT1.4 137,54 126.67,64.33 126.67,67.67 125.61,68.73 125.61,74.68 117.38,82.91 112.65,82.91 112.35,83.21 112.35,84.89 v112.96,85.5 113.57,86.11 115.19,86.11 CN_IN1.3
  Bottom 0.152: v70.71,55.63 70.71,55.68 70.11,56.29 70.11,56.79 70.46,57.15 72.23,57.15 100.58,85.5 v112.96,85.5
UART4_TX  (via drill 0.35)
  Top 0.152: v70.71,54.71 70.71,53.24 70.2,52.73 69.49,52.73 U1.P$10 | CN_OUT1.3 136,56 126.97,65.03 126.97,67.8 125.91,68.86 125.91,75.29 117.2,84 CN_IN1.4 115.2,84 113.44,84 v112.96,83.52
  Bottom 0.152: v70.71,54.71 77.91,54.71 96.04,72.85 102.29,72.85 v112.96,83.52
UART6_RX  (via drill 0.35)
  Top 0.152: v61.57,49.68 62.48,49.68 U1.P$33 | v129.42,30.94 129.57,31.09 J7.3 | CN_IN3.3 116.28,42.98 v117.38,42.98
  Bottom 0.152: v61.57,49.68 69.19,49.68 69.95,50.44 93.91,50.44 96.8,47.55 112.81,47.55 v117.38,42.98 v129.42,30.94
UART6_TX  (via drill 0.35)
  Top 0.152: v58.52,49.99 58.83,50.29 62.48,50.29 U1.P$32 | v120.12,37.95 126.52,31.55 153.55,31.55 153.71,31.7 154.92,31.7 J7.2 | v112.2,44.81 112.2,40.39 v112.65,39.93 115.23,39.93 CN_IN3.4
  Bottom 0.152: v58.52,49.99 58.98,49.99 63.86,45.11 65.08,45.11 65.38,44.81 65.99,44.81 67.82,46.63 69.19,46.63 71.17,48.62 87.35,48.62 96.04,39.93 v112.65,39.93 | v120.12,37.95 113.26,44.81 v112.2,44.81
UART7_RX  (via drill 0.35)
  Top 0.152: U1.P$29 61.78,51.75 61.72,51.81 59.49,51.81 57.91,50.24 57.91,49.74 58.21,49.44 58.21,47.87 57.99,47.65 57.99,47.15 59.5,45.64 v59.5,45.1 | v117.6,20 CN_IN4.3
  Bottom 0.152: v59.5,45.1 62.77,41.83 62.77,41.25 84.02,20 v117.6,20
UART7_TX
  Top 0.152: U1.P$38 63.87,47.45 63.87,46.37 65.08,45.16 65.08,40.92 62.81,38.65 62.1,38.65 61.47,38.02 61.47,36.43 62,35.89 64.21,35.89 77.2,22.9 77.2,12 78.3,10.9 116.72,10.9 117.8,11.98 117.8,17.6 117.4,18 CN_IN4.4
V12
  Top 0.3: U1.P$22 64.25,57.35 C4.2
V_PWR
  Top 0.8: CN_IN4.8 62,10 56.73,15.27 X6.1
  Top 1: C12.1 94,85.5 | 94,85.5 5V_BYP.1 104.08,82.42 110.5,76 CN_IN1.8 116.5,76 119,73.5 119,54.5 | U5.3 93.65,85.85 94,85.5 | 119,54.5 118.5,54 CN_IN2.8 | 119,54.5 119,46 | 119,46 119,32 | 119,32 CN_IN3.8 | 119,32 119,15 | 119,15 119,10 CN_IN4.8 | 119,46 CN_OUT1.8 | J6.1 119,15
VCC  (via drill 0.35)
  Top 0.152: 25.6,92.33 26.8,92.33 C13.1 | 25.6,92.33 25.6,90.09 19.64,84.13 U2.P$7 | 25.6,92.33 19.07,92.33 18.1,93.3 17.39,93.3 16.8,92.71 U3.P$7
  Top 0.2: 62.1,43.4 62.1,47.83 U1.P$36
  Top 0.3: U1.P$1 69.5,48.23 69.5,47.5 68.78,47.5 U1.P$48 70.6,45.67 C9.2 | C6.2 63.25,54.85 U1.P$24 | U1.P$9 70.75,52.25 | C3.1 71.5,53 70.75,52.25 | U1.P$7 70.25,51.25 70.75,51.75 70.75,52.25
  Top 0.5: J2.D2 35.43,91.07 29.87,91.07 C13.1 | J5.1 62.96,43.4 62.1,43.4 C10.2 54.4,46.5 C8.2 54.4,53.14 56.1,54.84 56.1,55.49 55.8,55.79 v55.8,58 55.8,59.57 55.95,59.72 55.95,60.37 55.49,60.83 54.84,60.83 40.32,46.3 28.74,46.3 | J3.P$7 J3.P$4 78.54,32.64 80.5,34.6 LED2.A 78.3,37 75.32,39.98 75.12,39.98 C9.2 v70.6,42.5 | v58,58.6 C6.2 | 28.74,70.7 28.74,74.84 27.48,76.1 12.1,76.1 11.52,76.68 J1.VCC | 28.74,70.7 28.74,57.5 | 28.74,57.5 28.74,46.3 | 28.74,46.3 28.74,40.5 | 28.74,40.5 28.74,24.06 29.23,23.57 D8.1 | D7.1 31.93,40.5 28.74,40.5 | D6.1 28.81,57.58 28.74,57.5 | D5.1 28.86,70.58 28.74,70.7
  Top 0.8: J2.D2 50.19,89.81 57.2,82.8 65,82.8
  Top 1: U4.2 65,82.8 65,81.5 65.5,81 65.5,79.1 C2.1 65.4,65.9 | C6.2 61.6,58.6 62.5,59.5 62.5,63 65.4,65.9 | 65.4,65.9 68.5,62.8 68.5,60 70,58.5 71.4,58.5 C3.1
  Bottom 0.5: J5.1 63.76,40.94 64.8,39.9 68,39.9 v70.6,42.5 | v55.8,58 57.4,58 v58,58.6

### Text on the board
tPlace: 3.3V | 5V | INPUT1 | LCD | INPUT2 | OUTPUT | INPUT3 | POWER | J7 | MODE | STATE | INPUT4 | VIN | GND | 9V | CPU DEBUG | WILD USB
tDocu: Board thickness: 1.6mmm